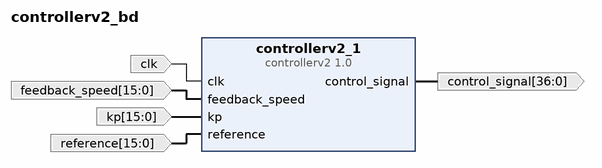
[diagram p0: block diagram of the top level]
# Vivado block design controllerv2_bd, Vivado 2015.4
create_bd_design controllerv2_bd

create_bd_port -dir I -type clk clk
create_bd_port -dir O -from 36 -to 0 -type data control_signal
create_bd_port -dir I -from 15 -to 0 -type data feedback_speed
create_bd_port -dir I -from 15 -to 0 -type data kp
create_bd_port -dir I -from 15 -to 0 -type data reference

create_bd_cell -type ip -vlnv User_Company:SysGen:controllerv2:1.0 controllerv2_1

# ---- connections ----

connect_bd_net [get_bd_ports clk] [get_bd_pins controllerv2_1/clk]
connect_bd_net [get_bd_pins controllerv2_1/control_signal] [get_bd_ports control_signal]
connect_bd_net [get_bd_ports feedback_speed] [get_bd_pins controllerv2_1/feedback_speed]
connect_bd_net [get_bd_ports kp] [get_bd_pins controllerv2_1/kp]
connect_bd_net [get_bd_ports reference] [get_bd_pins controllerv2_1/reference]

validate_bd_design
save_bd_design
